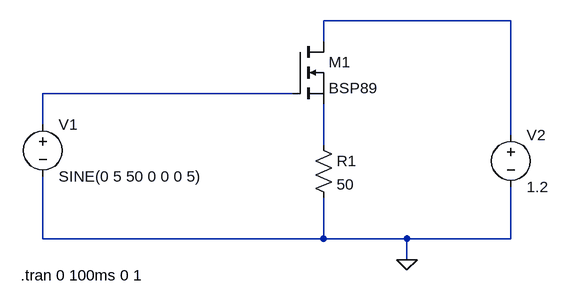
[diagram p0: schematic (3b) Emosfet souce follower.asc]
(3b) Emosfet souce follower.asc, the LTspice schematic file:
Version 4
SHEET 1 880 680
WIRE 704 -32 416 -32
WIRE 416 0 416 -32
WIRE 368 80 -16 80
WIRE -16 128 -16 80
WIRE 704 144 704 -32
WIRE 416 160 416 96
WIRE -16 304 -16 208
WIRE 416 304 416 240
WIRE 416 304 -16 304
WIRE 544 304 416 304
WIRE 704 304 704 224
WIRE 704 304 544 304
WIRE 544 336 544 304
FLAG 544 336 0
SYMBOL voltage -16 112 R0
WINDOW 123 0 0 Left 0
WINDOW 39 0 0 Left 0
SYMATTR InstName V1
SYMATTR Value SINE(0 5 50 0 0 0 5)
SYMBOL voltage 704 128 R0
WINDOW 123 0 0 Left 0
WINDOW 39 0 0 Left 0
SYMATTR InstName V2
SYMATTR Value 1.2
SYMBOL nmos 368 0 R0
SYMATTR InstName M1
SYMATTR Value BSP89
SYMBOL res 400 144 R0
SYMATTR InstName R1
SYMATTR Value 50
TEXT -50 360 Left 2 !.tran 0 100ms 0 1

The netlist it stands for:
* (3b) Emosfet souce follower.asc
V1 N002 0 SINE(0 5 50 0 0 0 5)
V2 N001 0 1.2
M1 N001 N002 N003 N003 BSP89
R1 N003 0 50
.model NMOS NMOS
.model PMOS PMOS
.lib standard.mos
.tran 0 100ms 0 1
.backanno
.end